# Altium schematic sheet POWER.SchDoc
size A4; Organization: Altium Limited; Address1: L3, 12a Rodborough Rd; Address2: Frenchs Forest; Address3: NSW; Address4: Australia 2086; SheetNumber: 4; SheetTotal: 7
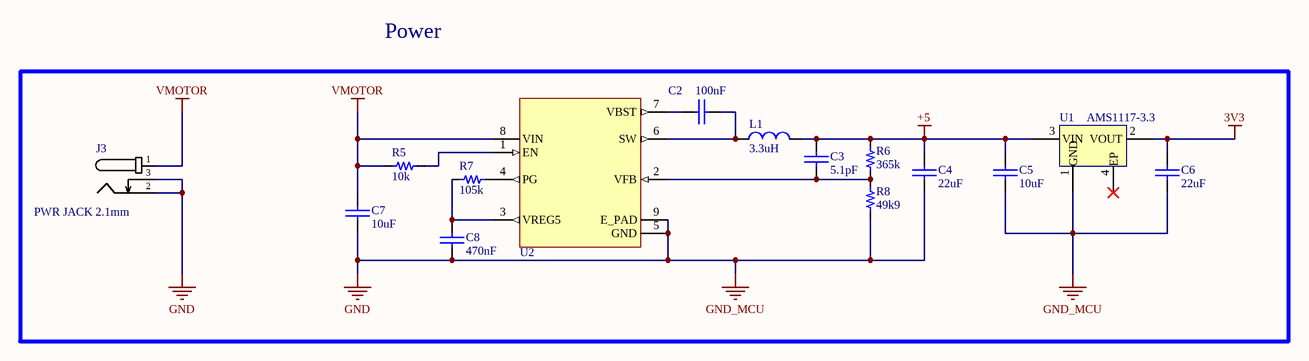
[diagram p0: POWER.SchDoc]

## Parts
C2  value 100nF  [0603_cap]  (hidden comment: CAP CER 100nF 50V X7R 0603)
C3  value 5.1pF  [0603_cap]  (hidden comment: Cap_5.1pF)
C4  value 22uF  [0603_cap]  (hidden comment: 22uF 10V)
C5  value 10uF  [0603_cap]  (hidden comment: 10uF 10V)
C6  value 22uF  [0603_cap]  (hidden comment: 22uF 10V)
C7  value 10uF  [0805_cap]  (hidden comment: 10uF 25V)
C8  value 470nF  [0603_cap]  (hidden comment: 470nF 50V)
J3  PWR JACK 2.1mm  [CON_POWER_BARREL_2.1MM_3CONN]
L1  value 3.3uH  [Inductor_3_3uH]  (hidden comment: FIXED IND 3.3uH 2.6A 0.052Ω SMD,4x4mm)
R5  value 10k  [0603_res]  (hidden comment: 10k 1/10W)
R6  value 365k  [0603_res]  (hidden comment: 365k 1/10W)
R7  value 105k  [0603_res]  (hidden comment: Res 105k)
R8  value 49k9  [0603_res]  (hidden comment: 49k9 1/10W)
U1  AMS1117-3.3  [SOT_223]
U2  TPS56528DDAR  [SOIC_8_3.9mm_EP]  (value not drawn)

## Nets
3V3: C6.1 U1.2(VOUT)
+5: C3.1 C4.1 C5.1 L1.2 R6.2 U1.3(VIN)
GND: C4.2 C5.2 C6.2 C7.2 C8.2 J3.2 J3.3 R8.1 U1.1(GND) U2.5(GND) U2.9(E_PAD)  [also labelled GND_MCU]
VMOTOR: C7.1 J3.1 R5.1 U2.8(VIN)
NetC2_1: C2.1 L1.1 U2.6(SW)
NetC2_2: C2.2 U2.7(VBST)
NetC3_2: C3.2 R6.1 R8.2 U2.2(VFB)
NetC8_1: C8.1 R7.1 U2.3(VREG5)
NetR5_2: R5.2 U2.1(EN)
NetR7_2: R7.2 U2.4(PG)

Not connected (* = marked no-connect by the designer): U1 4(EP)*

## Notes on the sheet
- Power
- Title
- Size:
- Date:
- A4
- Number:
- Time:
- Revision:
- Sheet
- of
- File:

## Library data of the parts
C2 = Cap_100nF_0603_50V: 50V 100nF X7R ±10% 0603 Ceramic Capacitors RoHS; Manufacturer: FOJAN; Manufacturer Part Number: FCC0603B104K500CT; Supplier 1: LCSC; Supplier Part Number 1: C5137636; ComponentLink1Description: LCSC; ComponentLink1URL: https://www.lcsc.com/product-detail/C5137636.html
C3 = Cap_5.1pF: 50V 5.1pF NP0 0603 Ceramic Capacitors RoHS; Manufacturer: YAGEO; Manufacturer Part Number: CC0603CRNPO9BN5R1; Supplier 1: LCSC; Supplier Part Number 1: C519376; ComponentLink1Description: LCSC; ComponentLink1URL: https://www.lcsc.com/product-detail/C519376.html?s_z=n_5.1pF%2520capacitor
C4 C6 = Cap_22uF_0603_10V: 10V 22uF X5R ±20% 0603 Multilayer Ceramic Capacitors MLCC - SMD/SMT ROHS; Manufacturer: HRE; Manufacturer Part Number: CGA0603X5R226M100JT; Supplier 1: LCSC; Supplier Part Number 1: C6119863; ComponentLink1Description: LCSC; ComponentLink1URL: https://lcsc.com/product-detail/Multilayer-Ceramic-Capacitors-MLCC-SMD-SMT_HRE-CGA0603X5R226M100JT_C6119863.html
C5 = Cap_10uF_0603_10V: 10V 10uF X5R ±10% 0603 Multilayer Ceramic Capacitors MLCC - SMD/SMT ROHS; Manufacturer: CCTC; Manufacturer Part Number: TCC0603X5R106K100CT; Supplier 1: LCSC; Supplier Part Number 1: C380314; ComponentLink1Description: LCSC; ComponentLink1URL: https://www.lcsc.com/product-detail/Multilayer-Ceramic-Capacitors-MLCC-SMD-SMT_CCTC-TCC0603X5R106K100CT_C380314.html
C7 = Cap_10uF_0805_25V_: 25V 10uF X5R ±10% 0805 Multilayer Ceramic Capacitors MLCC - SMD/SMT ROHS; Manufacturer: Samsung Electro-Mechanics; Manufacturer Part Number: CL21A106KAYNNNE; Supplier 1: LCSC; Supplier Part Number 1: C15850; ComponentLink1Description: LCSC; ComponentLink1URL: https://lcsc.com/product-detail/Multilayer-Ceramic-Capacitors-MLCC-SMD-SMT_Samsung-Electro-Mechanics-CL21A106KAYNNNE_C15850.html
C8 = Cap_470nF_0603_50V: 50V 470nF X7R ±10% 0603 Multilayer Ceramic Capacitors MLCC - SMD/SMT ROHS; Manufacturer: Chinocera; Manufacturer Part Number: HGC0603R7474K500NTHJ; Supplier 1: LCSC; Supplier Part Number 1: C33546006; ComponentLink1Description: LCSC; ComponentLink1URL: https://lcsc.com/product-detail/Multilayer-Ceramic-Capacitors-MLCC-SMD-SMT_Chinocera-HGC0603R7474K500NTHJ_C33546006.html
J3 = Con_Power_Jack_2.1mm_3pins: CONN PWR JACK 2X5.5MM SOLDER; Manufacturer: HCTL; Manufacturer Part Number: HC-DC-005-2.0T; Supplier 1: LCSC; Supplier Part Number 1: C3010533; ComponentLink1Description: LCSC; ComponentLink1URL: https://www.lcsc.com/product-detail/AC-DC-Power-Connectors_HCTL-HC-DC-005-2-0T_C3010533.html
L1 = Inductor_3.3uH: 2.6A 3.3uH Magnetic Shielded Inductor ±20% 3.6A 52mΩ SMD,4x4mm Fixed Inductors RoHS; Manufacturer: cjiang; Manufacturer Part Number: FNR4030S3R3MT; Supplier 1: LCSC; Supplier Part Number 1: C167870; ComponentLink1Description: LCSC; ComponentLink1URL: https://www.lcsc.com/product-detail/C167870.html?s_z=n_3.3uH%2520inductor
R5 = Res_10k_0603_1/10W: RES SMD 10k OHM 5% 1/10W 0603; Manufacturer: FOJAN; Manufacturer Part Number: FRC0603J103TS; ComponentLink1URL: https://www.lcsc.com/product-detail/Chip-Resistor-Surface-Mount_FOJAN-FRC0603J103TS_C2930027.html; Supplier 1: LCSC; Supplier Part Number 1: C2930027; ComponentLink1Description: LCSC
R6 = Res_365k_0603_1/10W: 100mW Thick Film Resistor 75V ±100ppm/℃ ±1% 365kΩ 0603 Chip Resistor - Surface Mount ROHS; Manufacturer: YAGEO; Manufacturer Part Number: RC0603FR-07365KL; ComponentLink1URL: https://lcsc.com/product-detail/Chip-Resistor-Surface-Mount_YAGEO-RC0603FR-07365KL_C185336.html; Supplier 1: LCSC; Supplier Part Number 1: C185336; ComponentLink1Description: LCSC
R7 = Res 105k: 100mW 105kΩ 75V ±25ppm/℃ Thin Film Resistor ±0.5% 0603 Chip Resistor - Surface Mount RoHS; Manufacturer: YAGEO; Manufacturer Part Number: RT0603DRD07105KL; ComponentLink1URL: https://www.lcsc.com/product-detail/C862523.html; Supplier 1: LCSC; Supplier Part Number 1: C862523; ComponentLink1Description: LCSC
R8 = Res_49k9_0603_1/10W: 100mW Thick Film Resistor 75V ±100ppm/℃ ±1% 49.9kΩ 0603 Chip Resistor - Surface Mount ROHS; Manufacturer: YAGEO; Manufacturer Part Number: RC0603FR-0749K9L; ComponentLink1URL: https://lcsc.com/product-detail/Chip-Resistor-Surface-Mount_YAGEO-RC0603FR-0749K9L_C114624.html; Supplier 1: LCSC; Supplier Part Number 1: C114624; ComponentLink1Description: LCSC
U1 = LDO_3V3_1A_FIXED: 1A 60dB@(120Hz) Fixed 3.3V Positive 18V SOT-223 Linear Voltage Regulators (LDO) ROHS; Manufacturer: UMW(Youtai Semiconductor Co., Ltd.); ComponentLink1Description: LCSC; ComponentLink1URL: https://www.lcsc.com/product-detail/_UMW-Youtai-Semiconductor-Co-Ltd-_C347222.html; Supplier 1: LCSC; Manufacturer Part Number: AMS1117-3.3; Supplier Part Number 1: C347222
U2 = DCDC_SW_BUCK_5A_SOIC8: IC REG BUCK ADJ 5A 8SOPWR; Manufacturer: Texas Instruments; Manufacturer Part Number: TPS56528DDAR; Supplier 1: LCSC; Supplier Part Number 1: C138716; ComponentLink1Description: LCSC; ComponentLink1URL: https://lcsc.com/product-detail/DC-DC-Converters_Texas-Instruments-TPS56528DDAR_C138716.html